# Altium schematic sheet 心率血氧检测仪1.SchDoc
size A4
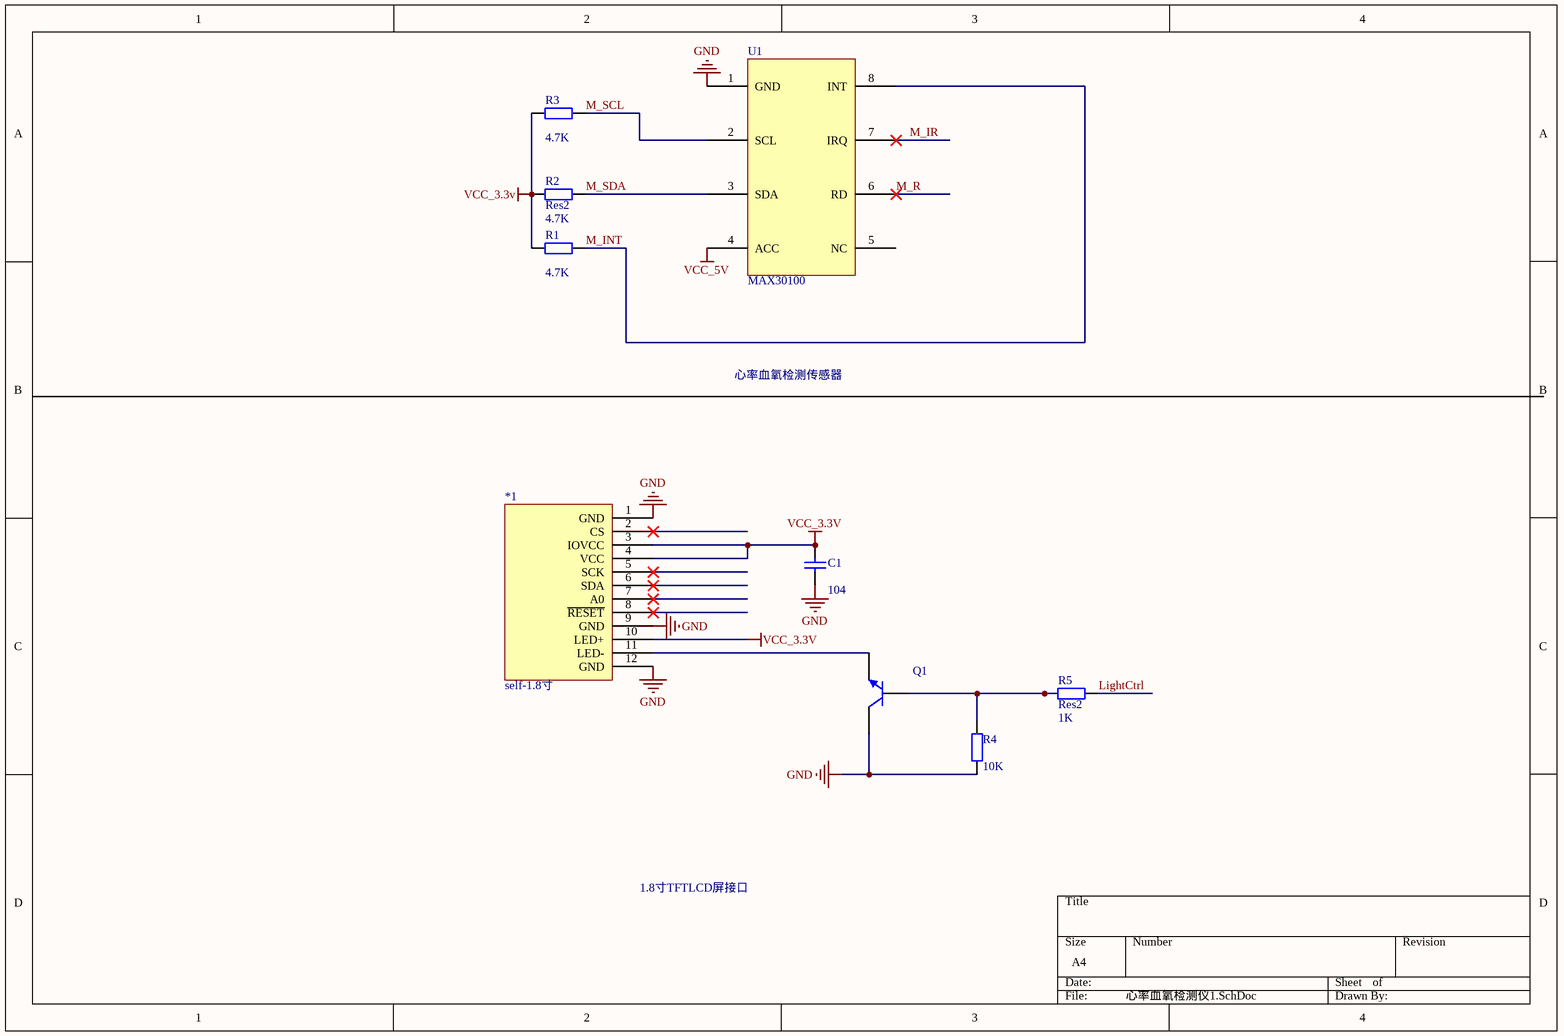
[diagram p0: 心率血氧检测仪1.SchDoc]

## Parts
*1  self-1.8寸  [self-1.8 - 1]
C1  value 104  [0805C]  (hidden comment: Cap)
Q1  2N3904  [三极管SOT23]  (value not drawn)
R1  value 4.7K  [0805]  (hidden comment: Res2)
R2  Res2  value 4.7K  [0805]
R3  value 4.7K  [0805]  (hidden comment: Res2)
R4  value 10K  [0805]  (hidden comment: Res2)
R5  Res2  value 1K  [0805]
U1  MAX30100  [MAX30100模块]

## Nets
GND: *1.1(GND) *1.9(GND) *1.12(GND) C1.1 Q1.3(C) R4.1 U1.1(GND)
VCC_3.3V: *1.3(IOVCC) *1.4(VCC) *1.10(LED+) C1.2 R1.1 R2.1 R3.1
VCC_5V: U1.4(ACC)
LightCtrl: R5.2
M_INT: R1.2 U1.8(INT)
M_IR: U1.7(IRQ)
M_R: U1.6(RD)
M_SCL: R3.2 U1.2(SCL)
M_SDA: R2.2 U1.3(SDA)
Net*1_11: *1.11(LED-) Q1.1(E)
NetQ1_2: Q1.2(B) R4.2 R5.1

Not connected (* = marked no-connect by the designer): *1 2(CS)* 5(SCK)* 6(SDA)* 7(A0)* 8(~{RESET})*; U1 5(NC)

## Notes on the sheet
- 心率血氧检测传感器
- 1.8寸TFTLCD屏接口

## Library data of the parts
C1 = Cap: Capacitor; Published: 8-Jun-2000; LatestRevisionDate: 17-Jul-2002; LatestRevisionNote: Re-released for DXP Platform.; PackageReference: RAD-0.3; Publisher: Altium Limited; PackageDescription: Radial Cap, Thru-Hole; 2 Leads; 0.3 in Pin Spacing
Q1 = 2N3904: NPN General Purpose Amplifier; Published: 8-Jun-2000; LatestRevisionDate: 15-Jan-2003; LatestRevisionNote: PCB Footprint 'BCY-W3/D4.7' replaced; DatasheetVersion: 1997; PackageVersion: Sep-1998; PackageReference: TO-92A; Publisher: Altium Limited; PackageDescription: TO, Flat Index; 3 In-Line, Axial Leads; Body Dia. 4.5mm; Leads 0.51 x 0.48 mm (max); ComponentLink1Description: Manufacturer Link; ComponentLink1URL: http://www.fairchildsemi.com/; ComponentLink2Description: Datasheet; ComponentLink2URL: http://www.fairchildsemi.com/ds/2N%2F2N3904.pdf
R1-R5 = Res2: Resistor; Published: 8-Jun-2000; LatestRevisionDate: 17-Jul-2002; LatestRevisionNote: Re-released for DXP Platform.; PackageReference: AXIAL-0.4; Publisher: Altium Limited; PackageDescription: Axial Device, Thru-Hole; 2 Leads; 0.4 in Pin Spacing